# Altium schematic sheet SM1.SchDoc
size A
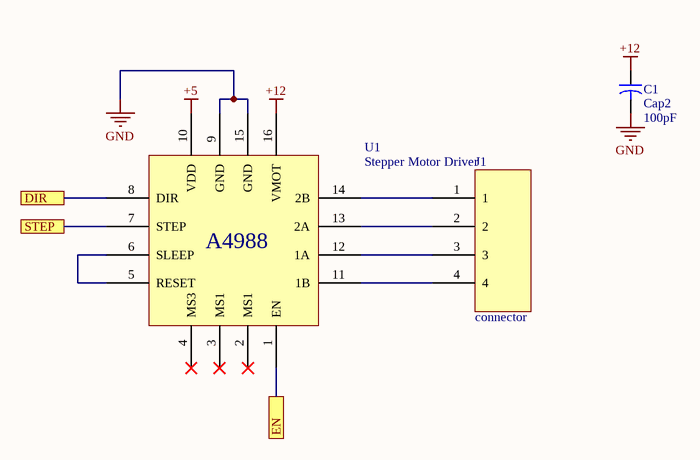
[diagram p0: SM1.SchDoc]

## Parts
C1  Cap2  value 100pF  [CAPR5-4X5]
J1  connector  [JST_4P]
U1  Stepper Motor Driver  [A4988]

## Ports
DIR, EN, STEP

## Nets
+5: U1.10(VDD)
+12: C1.1 U1.16(VMOT)
GND: C1.2 U1.9(GND) U1.15(GND)
DIR: U1.8(DIR) ; port DIR
EN: U1.1(EN) ; port EN
STEP: U1.7(STEP) ; port STEP
NetJ1_1: J1.1 U1.14(2B)
NetJ1_2: J1.2 U1.13(2A)
NetJ1_3: J1.3 U1.12(1A)
NetJ1_4: J1.4 U1.11(1B)
NetU1_5: U1.5(RESET) U1.6(SLEEP)

Not connected (* = marked no-connect by the designer): U1 2(MS1)* 3(MS1)* 4(MS3)*

## Library data of the parts
C1 = Cap2: Capacitor; Published: 23-Sep-2002; PackageReference: CAPR5-4X5; Publisher: Altium Limited; PackageDescription: Capacitor; 2 Leads
J1 = JST_4P
U1 = A4988